# EAGLE schematic Circuit_diagram (EAGLE 9.6.2)
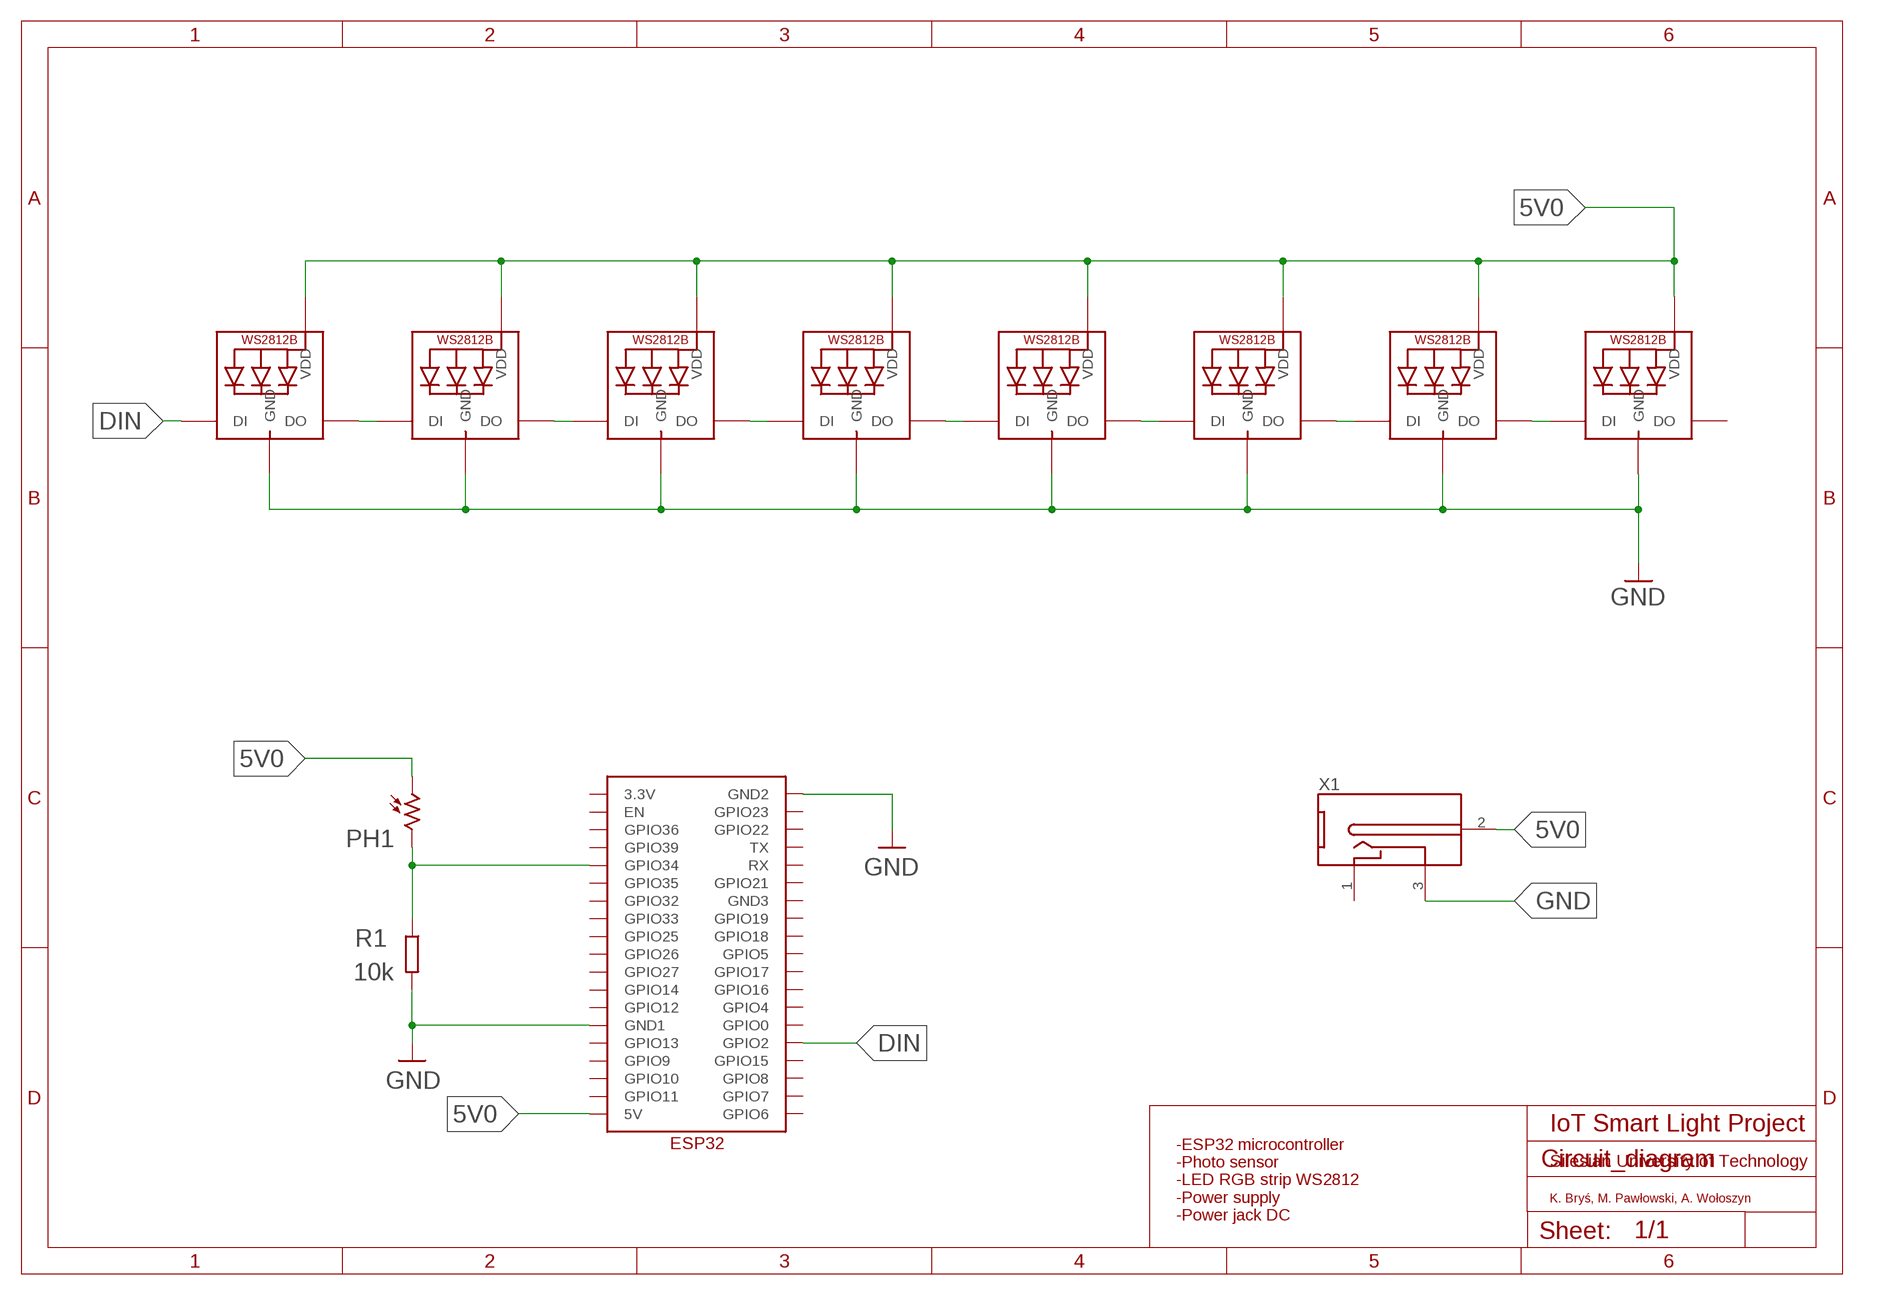
[diagram p0: schematic, sheet 1]

## Parts
LED1  WS2812B3535  [LED3535]
LED2  WS2812B3535  [LED3535]
LED3  WS2812B3535  [LED3535]
LED4  WS2812B3535  [LED3535]
LED5  WS2812B3535  [LED3535]
LED6  WS2812B3535  [LED3535]
LED7  WS2812B3535  [LED3535]
LED8  WS2812B3535  [LED3535]
PH1  W5560_11  [W55XX]
R1  10k  R-EU_0204/2V  [0204V]
U$2  ESP32  [ESP32]
X1  DC-2.1MM-5MM  [DC-21MM]

## Nets
5V0: LED1.2(VDD) LED2.2(VDD) LED3.2(VDD) LED4.2(VDD) LED5.2(VDD) LED6.2(VDD) LED7.2(VDD) LED8.2(VDD) PH1.1 U$2.5V X1.2
DIN: LED1.1(DI) U$2.GPIO2
GND: R1.2 U$2.GND1 U$2.GND2 X1.3
N$1: LED1.3(DO) LED2.1(DI)
N$2: LED2.3(DO) LED4.1(DI)
N$3: LED4.3(DO) LED7.1(DI)
N$4: LED3.1(DI) LED7.3(DO)
N$5: LED3.3(DO) LED8.1(DI)
N$6: LED6.1(DI) LED8.3(DO)
N$7: LED5.1(DI) LED6.3(DO)
N$8: LED1.4(GND) LED2.4(GND) LED3.4(GND) LED4.4(GND) LED5.4(GND) LED6.4(GND) LED7.4(GND) LED8.4(GND) ; supply symbol labelled GND
N$9: PH1.2 R1.1 U$2.GPIO34
Unconnected: LED5.3(DO) U$2.3.3V U$2.EN U$2.GND3 U$2.GPIO0 U$2.GPIO4 U$2.GPIO5 U$2.GPIO6 U$2.GPIO7 U$2.GPIO8 U$2.GPIO9 U$2.GPIO10 U$2.GPIO11 U$2.GPIO12 U$2.GPIO13 U$2.GPIO14 U$2.GPIO15 U$2.GPIO16 U$2.GPIO17 U$2.GPIO18 U$2.GPIO19 U$2.GPIO21 U$2.GPIO22 U$2.GPIO23 U$2.GPIO25 U$2.GPIO26 U$2.GPIO27 U$2.GPIO32 U$2.GPIO33 U$2.GPIO35 U$2.GPIO36 U$2.GPIO39 U$2.RX U$2.TX

## Notes on the sheet
- IoT Smart Light Project
- Silesian University of Technology
- K. Bryś, M. Pawłowski, A. Wołoszyn
- -ESP32 microcontroller
  -Photo sensor
  -LED RGB strip WS2812
  -Power supply
  -Power jack DC

## Power pins joined to a net without a drawn wire
1: X1.1

## Library data of the parts
LED1-LED8 = adafruit:WS2812B
PH1 = photo-elements:W55: Photo Sensor Oil Burner Control Applications Source: http://optoelectronics.perkinelmer.com/content/Datasheets/DTS_PhotocellsD1160.pdf
R1 = rcl:R-EU_: RESISTOR, European symbol; SPICEPREFIX: R
U$2 = ESP32:ESP32
X1 = power-jack:DC: 5mm x 2.1mm jack